# Altium schematic sheet Driver.SchDoc
size A3
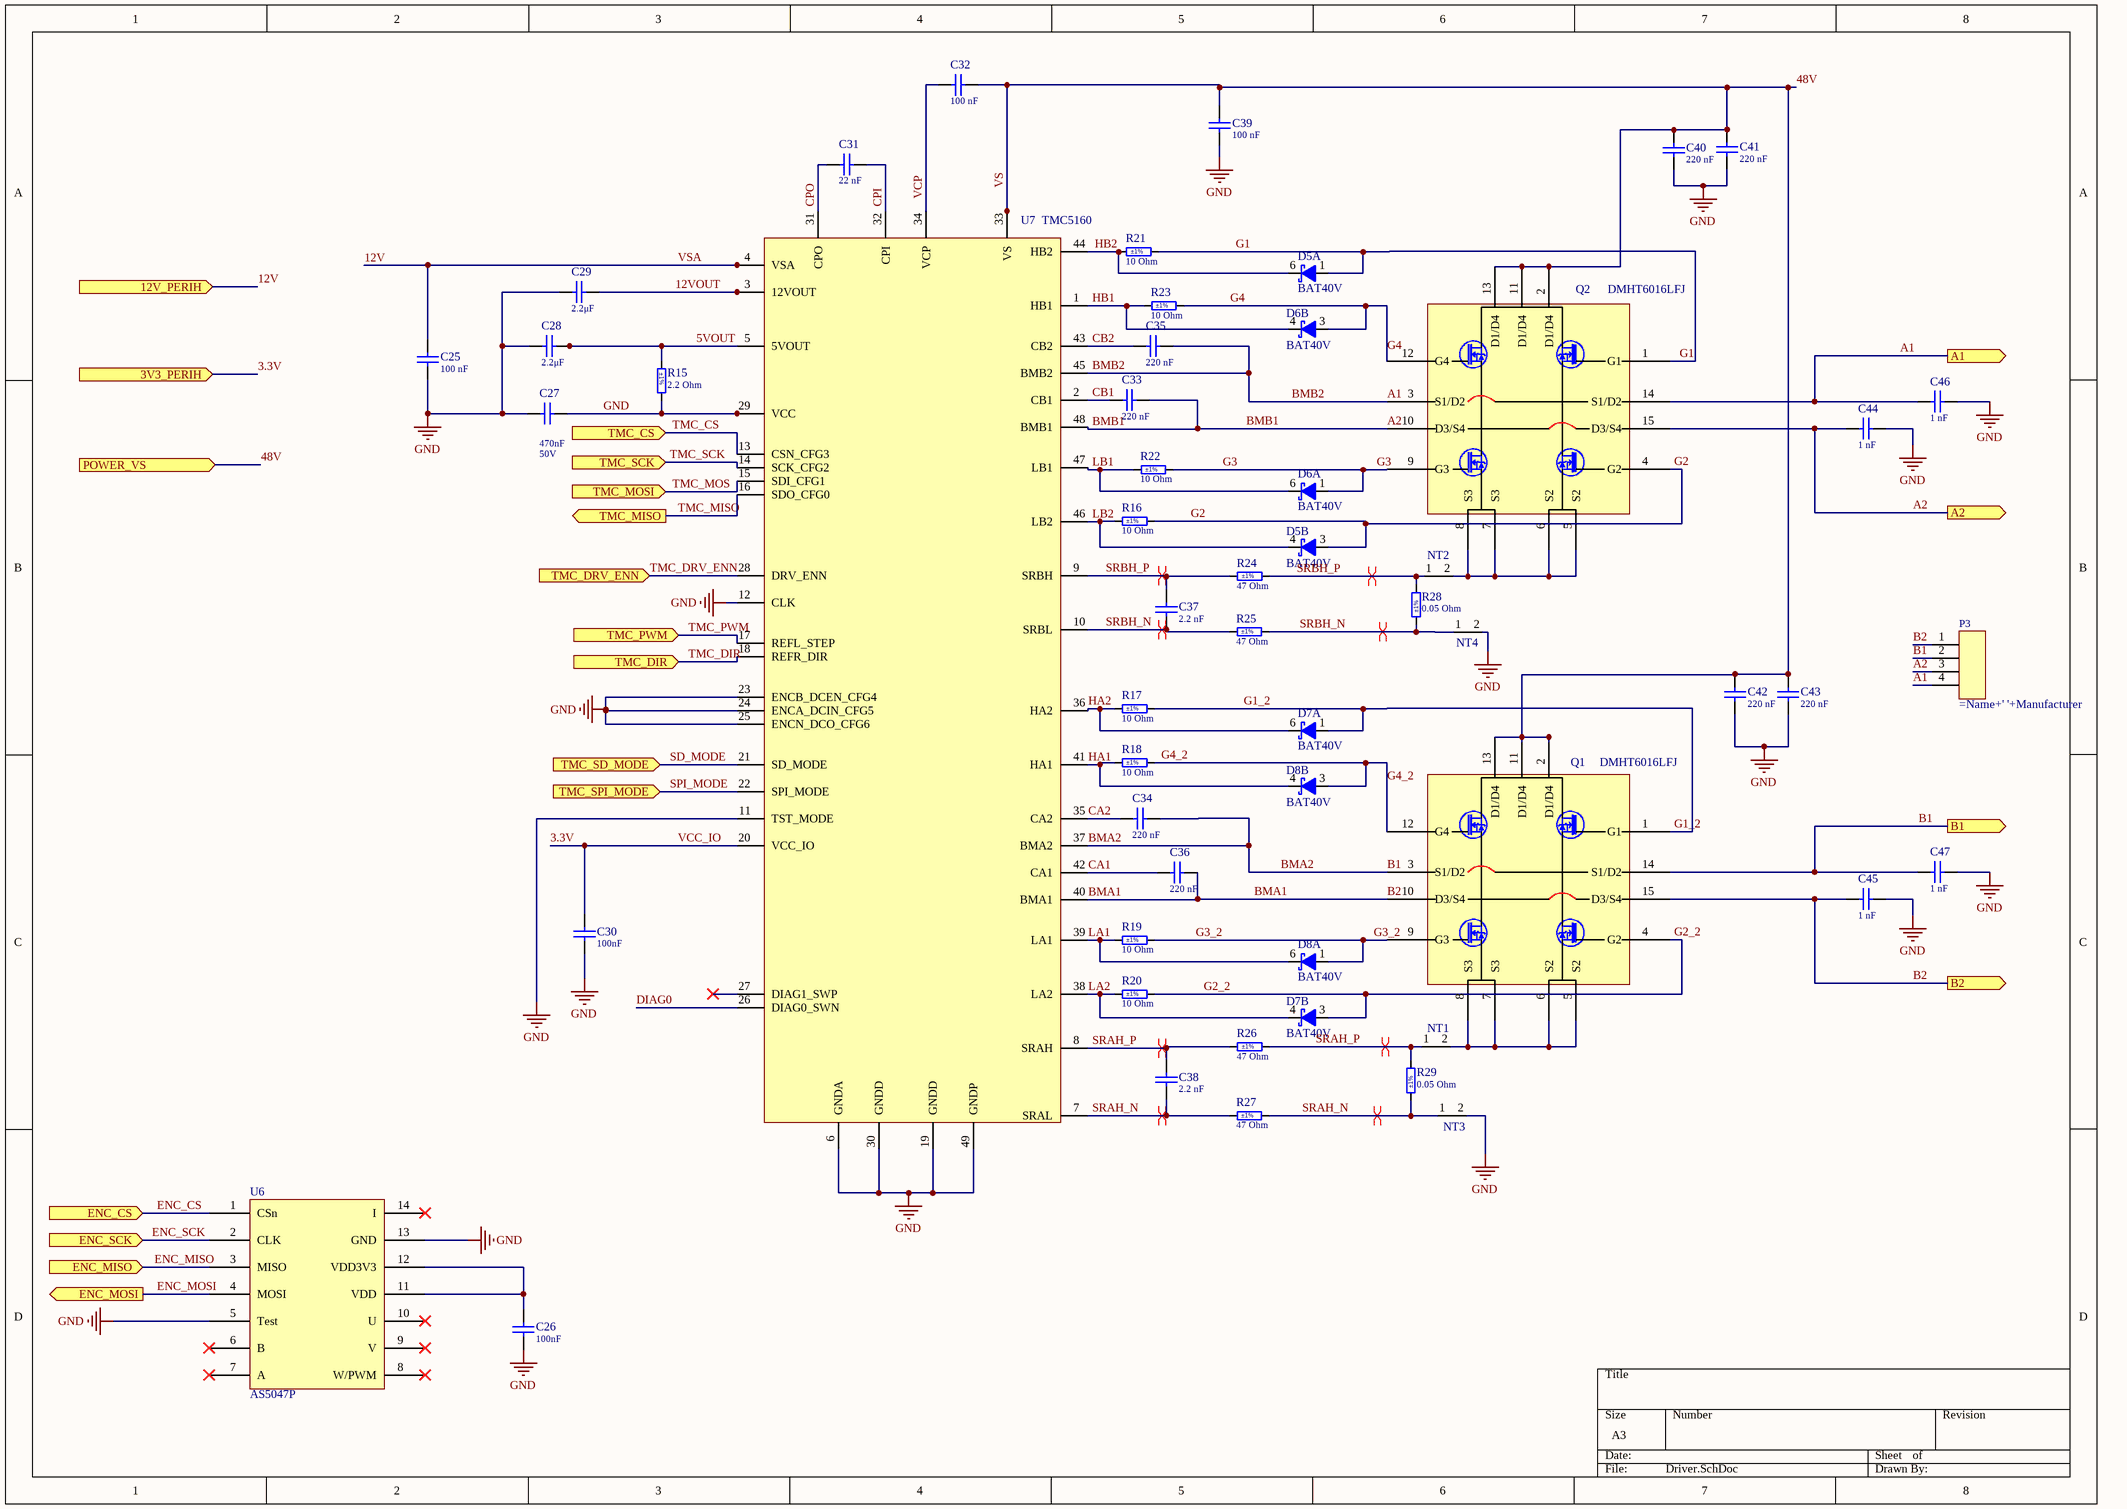
[diagram p0: Driver.SchDoc]

## Parts
C25  Capacitance: 100 nF  [0402]  (hidden comment: 100 nF 100V X5R ±10% 0402)
C26  Capacitance: 100nF  [0402]  (hidden comment: 100nF 16V X7R ±10% 0402)
C27  Capacitance: 470nF  Voltage: 50V  [0402]  (hidden comment: 470nF 50V ±10% 0402)
C28  Capacitance: 2.2μF  [0402]  (hidden comment: 2.2μF 16V X5R 20% 0402)
C29  Capacitance: 2.2μF  [0402]  (hidden comment: 2.2μF 16V X5R 20% 0402)
C30  Capacitance: 100nF  [0402]  (hidden comment: 100nF 16V X7R ±10% 0402)
C31  Capacitance: 22 nF  [0603]  (hidden comment: 22 nF 100V X7R ±10% 0603)
C32  Capacitance: 100 nF  [0402]  (hidden comment: 100 nF 100V X5R ±10% 0402)
C33  Capacitance: 220 nF  [0402]  (hidden comment: 220 nF 25 X7R ±10% 0402)
C34  Capacitance: 220 nF  [0402]  (hidden comment: 220 nF 25 X7R ±10% 0402)
C35  Capacitance: 220 nF  [0603]  (hidden comment: 220 nF 25 X7R ±10% 0603)
C36  Capacitance: 220 nF  [0603]  (hidden comment: 220 nF 25 X7R ±10% 0603)
C37  Capacitance: 2.2 nF  [0402]  (hidden comment: 2.2 nF 100V X7R ±10% 0402)
C38  Capacitance: 2.2 nF  [0402]  (hidden comment: 2.2 nF 100V X7R ±10% 0402)
C39  Capacitance: 100 nF  [0402]  (hidden comment: 100 nF 100V X5R ±10% 0402)
C40  Capacitance: 220 nF  [0603]  (hidden comment: 220 nF 100V X7S ±10% 0603)
C41  Capacitance: 220 nF  [0603]  (hidden comment: 220 nF 100V X7S ±10% 0603)
C42  Capacitance: 220 nF  [0603]  (hidden comment: 220 nF 100V X7S ±10% 0603)
C43  Capacitance: 220 nF  [0603]  (hidden comment: 220 nF 100V X7S ±10% 0603)
C44  Capacitance: 1 nF  [0402]  (hidden comment: 1 nF 100V X7R ±10% 0402)
C45  Capacitance: 1 nF  [0402]  (hidden comment: 1 nF 100V X7R ±10% 0402)
C46  Capacitance: 1 nF  [0402]  (hidden comment: 1 nF 100V X7R ±10% 0402)
C47  Capacitance: 1 nF  [0402]  (hidden comment: 1 nF 100V X7R ±10% 0402)
D5  BAT40V  [SOT563-6]  (parts A,B of 2)
D6  BAT40V  [SOT563-6]  (parts A,B of 2)
D7  BAT40V  [SOT563-6]  (parts A,B of 2)
D8  BAT40V  [SOT563-6]  (parts A,B of 2)
NT1  Net_Tie  [Net_Tie]  (value not drawn)  (net tie, no BOM)
NT2  Net_Tie  [Net_Tie]  (value not drawn)  (net tie, no BOM)
NT3  Net_Tie  [Net_Tie]  (value not drawn)  (net tie, no BOM)
NT4  Net_Tie  [Net_Tie]  (value not drawn)  (net tie, no BOM)
P3  (no value)  [15EDGRC-3.5-04P]
Q1  DMHT6016LFJ  [V-DFN5045-12 (Type B)]
Q2  DMHT6016LFJ  [V-DFN5045-12 (Type B)]
R15  Resistance: 2.2 Ohm  [0603]  (hidden comment: 2.2 Ohm 1/10 W 0603)
R16  Resistance: 10 Ohm  [0402]  (hidden comment: 10 Ohm 1/16 W 0402)
R17  Resistance: 10 Ohm  [0402]  (hidden comment: 10 Ohm 1/16 W 0402)
R18  Resistance: 10 Ohm  [0402]  (hidden comment: 10 Ohm 1/16 W 0402)
R19  Resistance: 10 Ohm  [0402]  (hidden comment: 10 Ohm 1/16 W 0402)
R20  Resistance: 10 Ohm  [0402]  (hidden comment: 10 Ohm 1/16 W 0402)
R21  Resistance: 10 Ohm  [0402]  (hidden comment: 10 Ohm 1/16 W 0402)
R22  Resistance: 10 Ohm  [0402]  (hidden comment: 10 Ohm 1/16 W 0402)
R23  Resistance: 10 Ohm  [0402]  (hidden comment: 10 Ohm 1/16 W 0402)
R24  Resistance: 47 Ohm  [0402]  (hidden comment: 47 Ohm 1/16 W 0402)
R25  Resistance: 47 Ohm  [0402]  (hidden comment: 47 Ohm 1/16 W 0402)
R26  Resistance: 47 Ohm  [0402]  (hidden comment: 47 Ohm 1/16 W 0402)
R27  Resistance: 47 Ohm  [0402]  (hidden comment: 47 Ohm 1/16 W 0402)
R28  Resistance: 0.05 Ohm  [1206]  (hidden comment: 0.05 Ohm 1 W 1206)
R29  Resistance: 0.05 Ohm  [1206]  (hidden comment: 0.05 Ohm 1 W 1206)
U6  AS5047P  [TSSOP-14-0.65]
U7  TMC5160  [TQFP48-0.5-EP]

## Ports
3V3_PERIH (in), 12V_PERIH (in), A1 (out), A2 (out), B1 (out), B2 (out), ENC_CS (in), ENC_MISO (in), ENC_MOSI (out), ENC_SCK (in), POWER_VS (in), TMC_CS (in), TMC_DIR (in), TMC_DRV_ENN (in), TMC_MISO (out), TMC_MOSI (in), TMC_PWM (in), TMC_SCK (in), TMC_SD_MODE (in), TMC_SPI_MODE (in)

## Nets
GND: C25.2 C26.1 C27.1 C27.2 C28.1 C29.1 C30.1 C39.2 C40.2 C41.1 C42.1 C43.1 C44.1 C45.1 C46.1 C47.1 NT3.2 NT4.2 R15.2 U6.5(Test) U6.13(GND) U7.6(GNDA) U7.11(TST_MODE) U7.12(CLK) U7.19(GNDD) U7.23(ENCB_DCEN_CFG4) U7.24(ENCA_DCIN_CFG5) U7.25(ENCN_DCO_CFG6) U7.29(VCC) U7.30(GNDD) U7.49(GNDP)
3.3V: C30.2 U7.20(VCC_IO) ; port 3V3_PERIH  [also labelled VCC_IO]
5VOUT: C28.2 R15.1 U7.5(5VOUT)
12V: C25.1 U7.4(VSA) ; port 12V_PERIH  [also labelled VSA]
12VOUT: C29.2 U7.3(12VOUT)
48V: C32.2 C39.1 C40.1 C41.2 C42.2 C43.2 Q1.2(D1/D4) Q1.11(D1/D4) Q1.13(D1/D4) Q2.2(D1/D4) Q2.11(D1/D4) Q2.13(D1/D4) U7.33(VS) ; port POWER_VS  [also labelled VS]
A1: C35.2 C46.2 P3.4 Q2.3(S1/D2) Q2.14(S1/D2) U7.45(BMB2) ; port A1  [also labelled BMB2]
A2: C33.2 C44.2 P3.3 Q2.10(D3/S4) Q2.15(D3/S4) U7.48(BMB1) ; port A2  [also labelled BMB1]
B1: C34.2 C47.2 P3.2 Q1.3(S1/D2) Q1.14(S1/D2) U7.37(BMA2) ; port B1  [also labelled BMA2]
B2: C36.2 C45.2 P3.1 Q1.10(D3/S4) Q1.15(D3/S4) U7.40(BMA1) ; port B2  [also labelled BMA1]
CA1: C36.1 U7.42(CA1)
CA2: C34.1 U7.35(CA2)
CB1: C33.1 U7.2(CB1)
CB2: C35.1 U7.43(CB2)
CPI: C31.2 U7.32(CPI)
CPO: C31.1 U7.31(CPO)
DIAG0: U7.26(DIAG0_SWN)
ENC_CS: U6.1(CSn) ; port ENC_CS
ENC_MISO: U6.3(MISO) ; port ENC_MISO
ENC_MOSI: U6.4(MOSI) ; port ENC_MOSI
ENC_SCK: U6.2(CLK) ; port ENC_SCK
G1: D5.1 Q2.1(G1) R21.2
G1_2: D7.1 Q1.1(G1) R17.2
G2: D5.3 Q2.4(G2) R16.2
G2_2: D7.3 Q1.4(G2) R20.2
G3: D6.1 Q2.9(G3) R22.2
G3_2: D8.1 Q1.9(G3) R19.2
G4: D6.3 Q2.12(G4) R23.2
G4_2: D8.3 Q1.12(G4) R18.2
HA1: D8.4 R18.1 U7.41(HA1)
HA2: D7.6 R17.1 U7.36(HA2)
HB1: D6.4 R23.1 U7.1(HB1)
HB2: D5.6 R21.1 U7.44(HB2)
LA1: D8.6 R19.1 U7.39(LA1)
LA2: D7.4 R20.1 U7.38(LA2)
LB1: D6.6 R22.1 U7.47(LB1)
LB2: D5.4 R16.1 U7.46(LB2)
SD_MODE: U7.21(SD_MODE) ; port TMC_SD_MODE
SPI_MODE: U7.22(SPI_MODE) ; port TMC_SPI_MODE
SRAH_N: C38.1 NT3.1 R27.1 R27.2 R29.1 U7.7(SRAL)
SRAH_P: C38.2 NT1.1 R26.1 R26.2 R29.2 U7.8(SRAH)
SRBH_N: C37.1 NT4.1 R25.1 R25.2 R28.1 U7.10(SRBL)
SRBH_P: C37.2 NT2.1 R24.1 R24.2 R28.2 U7.9(SRBH)
TMC_CS: U7.13(CSN_CFG3) ; port TMC_CS
TMC_DIR: U7.18(REFR_DIR) ; port TMC_DIR
TMC_DRV_ENN: U7.28(DRV_ENN) ; port TMC_DRV_ENN
TMC_MISO: U7.16(SDO_CFG0) ; port TMC_MISO
TMC_MOS: U7.15(SDI_CFG1) ; port TMC_MOSI
TMC_PWM: U7.17(REFL_STEP) ; port TMC_PWM
TMC_SCK: U7.14(SCK_CFG2) ; port TMC_SCK
VCP: C32.1 U7.34(VCP)
NetC26_2: C26.2 U6.11(VDD) U6.12(VDD3V3)
NetNT1_2: NT1.2 Q1.5(S2) Q1.6(S2) Q1.7(S3) Q1.8(S3)
NetNT2_2: NT2.2 Q2.5(S2) Q2.6(S2) Q2.7(S3) Q2.8(S3)

Not connected (* = marked no-connect by the designer): U6 6(B)* 7(A)* 8(W/PWM)* 9(V)* 10(U)* 14(I)*; U7 27(DIAG1_SWP)*

## Layout directives
differential pair: SRAH_N, SRAH_P, SRBH_N, SRBH_P

## Notes on the sheet
- Labels drawn without touching a wire or pin: GND

## Library data of the parts
C25 C32 C39 = Capacitor ceramic: Ceramic capacitor; Manufacturer: MURATA; Name: GRM155R62A104KE14D; Voltage: 100V; Tolerance: ±10%; Dielectric: X5R; BOMString: =Capacitance+' '+Voltage+' '+Tolerance+' '+Footprint; HelpURL: *; Supplier: *
C26 C30 = Capacitor ceramic: Ceramic capacitor; Manufacturer: Yageo; Name: CC0402KRX7R7BB104; Voltage: 16V; Tolerance: ±10%; Dielectric: X7R; BOMString: =Capacitance+' '+Voltage+' '+Tolerance+' '+Footprint; HelpURL: *; Supplier: *
C27 = Cap: Capacitor; Manufacturer: Walsin; Name: 0402X474K500CT; Tolerance: ±10%; BOMString: =Capacitance+' '+Voltage+' '+Tolerance+' '+Footprint; HelpURL: *; Supplier: *
C28 C29 = Capacitor ceramic: Ceramic capacitor; Manufacturer: FH; Name: 0402X225M160NT; Voltage: 16V; Tolerance: 20%; Dielectric: X5R; BOMString: =Capacitance+' '+Voltage+' '+Tolerance+' '+Footprint; HelpURL: *; Supplier: *
  C28: Parameter 1: *
C31 = Capacitor ceramic: Ceramic capacitor; Manufacturer: Yageo; Name: CC0603KRX7R0BB223; Voltage: 100V; Tolerance: ±10%; Dielectric: X7R; BOMString: =Capacitance+' '+Voltage+' '+Tolerance+' '+Footprint; HelpURL: *; Supplier: *
C33-C36 = Capacitor ceramic: Ceramic capacitor; Manufacturer: CCTC; Voltage: 25; Name: TCC0402X7R224K250AT; Tolerance: ±10%; Dielectric: X7R; BOMString: =Capacitance+' '+Voltage+' '+Tolerance+' '+Footprint; HelpURL: *; Supplier: *
C37 C38 = Capacitor ceramic: Ceramic capacitor; Manufacturer: CCTC; Name: GRM155R72A222KA01D; Voltage: 100V; Tolerance: ±10%; Dielectric: X7R; BOMString: =Capacitance+' '+Voltage+' '+Tolerance+' '+Footprint; HelpURL: *; Supplier: *
C40-C43 = Capacitor ceramic: Ceramic capacitor; Manufacturer: Taiyo Yuden; Name: HMK107C7224KAHTE; Voltage: 100V; Tolerance: ±10%; Dielectric: X7S; BOMString: =Capacitance+' '+Voltage+' '+Tolerance+' '+Footprint; HelpURL: *; Supplier: *
C44-C47 = Capacitor ceramic: Ceramic capacitor; Manufacturer: Yageo; Name: CC0402KRX7R0BB102; Voltage: 100V; Tolerance: ±10%; Dielectric: X7R; BOMString: =Capacitance+' '+Voltage+' '+Tolerance+' '+Footprint; HelpURL: *; Supplier: *
P3 = TerminalBlock4: Manufacturer: Dinkle; Name: 15EDGRC-3.5-04P; HelpURL: https://static.chipdip.ru/lib/874/DOC000874642.pdf; Supplier: https://www.chipdip.ru/product/ech381v-05p
R15 = Resistor: Thik Film Chip Resistor; Manufacturer: Uniohm; Power: 1/10 W; Tolerance: ±1%; Name: 0603WAF220KT5E; Supplier: *; HelpURL: *; BOMString: =Resistance+' '+Tolerance+' '+Power+' '+Footprint
R16-R23 = Resistor: Thik Film Chip Resistor; Manufacturer: Yageo; Power: 1/16 W; Tolerance: ±1%; Name: AC0402FR-0710RL; Supplier: *; HelpURL: *; BOMString: =Resistance+' '+Tolerance+' '+Power+' '+Footprint
R24-R27 = Resistor: Thik Film Chip Resistor; Manufacturer: Yageo; Power: 1/16 W; Tolerance: ±1%; Name: RC0402FR-0747RL; Supplier: *; HelpURL: *; BOMString: =Resistance+' '+Tolerance+' '+Power+' '+Footprint
R28 R29 = Resistor: Thik Film Chip Resistor; Manufacturer: Panasonic; Power: 1 W; Tolerance: ±1%; Name: ERJ-8CWFR050V; Supplier: *; HelpURL: *; BOMString: =Resistance+' '+Tolerance+' '+Power+' '+Footprint
Q1 Q2 = DMHT6016LFJ: Name: *; Manufacturer: *; BOMString: *; Value I: *; Value U: *